# EAGLE design sw-4416-project-v2 (EAGLE 6.2)
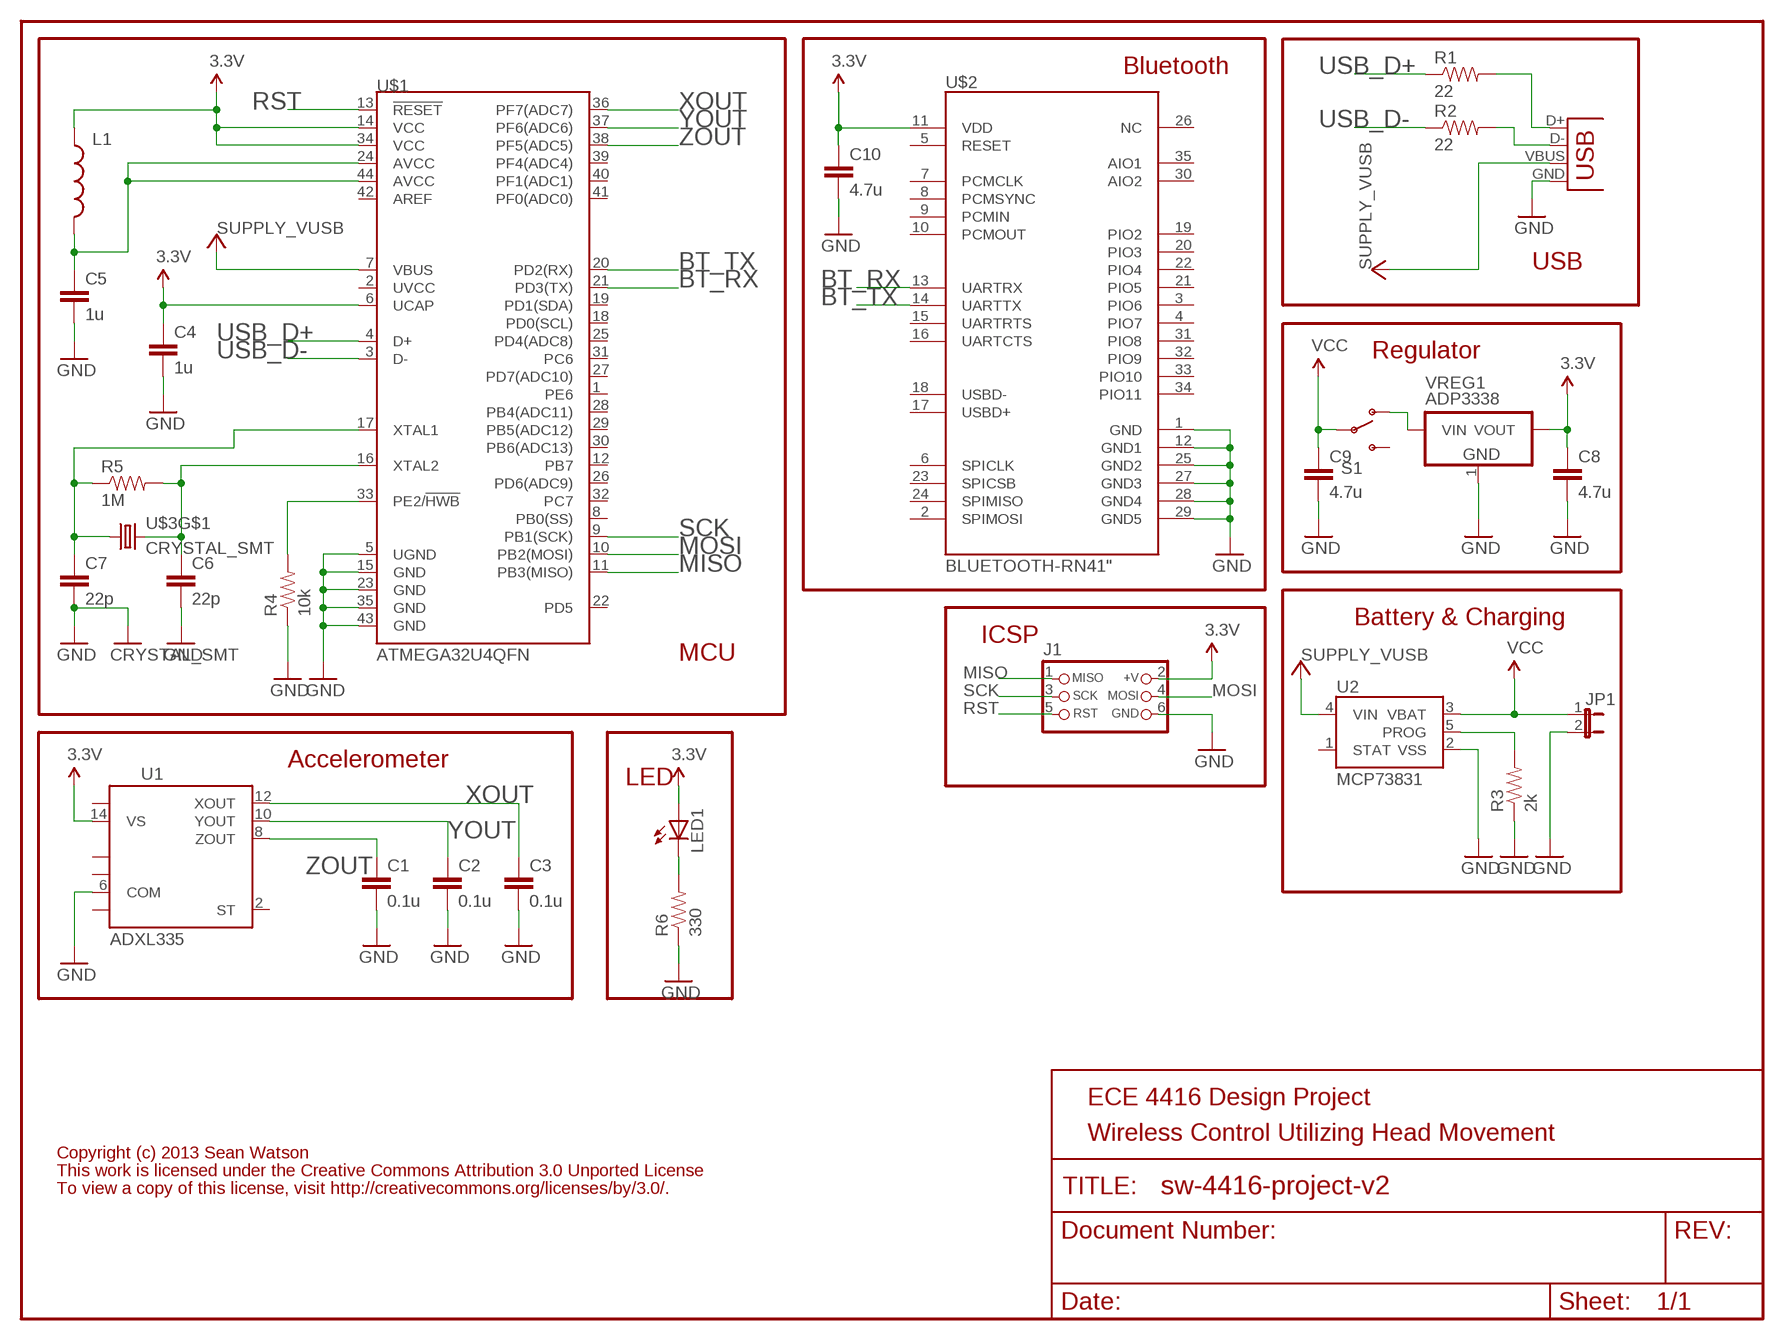
[diagram p0: schematic, sheet 1]

## Parts
C1  0.1u  CAP0603-CAP  [0603-CAP]
C2  0.1u  CAP0603-CAP  [0603-CAP]
C3  0.1u  CAP0603-CAP  [0603-CAP]
C4  1u  CAP0603-CAP  [0603-CAP]
C5  1u  CAP0603-CAP  [0603-CAP]
C6  22p  CAP0603-CAP  [0603-CAP]
C7  22p  CAP0603-CAP  [0603-CAP]
C8  4.7u  CAP0603-CAP  [0603-CAP]
C9  4.7u  CAP0603-CAP  [0603-CAP]
C10  4.7u  CAP0603-CAP  [0603-CAP]
J1  CON_HEADER_PRG_AVR_ICSP"  [HEADER_PRG_2X03_SMD]
JP1  JUMPER-2PTH  [1X02]
L1  INDUCTOR0805  [0805]
LED1  LED0603  [LED-0603]
R1  22  RESISTOR0603-RES  [0603-RES]
R2  22  RESISTOR0603-RES  [0603-RES]
R3  2k  RESISTOR0603-RES  [0603-RES]
R4  10k  RESISTOR0603-RES  [0603-RES]
R5  1M  RESISTOR0603-RES  [0603-RES]
R6  330  RESISTOR0603-RES  [0603-RES]
S1  SWITCH-SPST-SMD-A  [SWITCH-SPST-SMD-A]
U1  ADXL335  [LFCSP-16]
U2  MCP73831  [SOT23-5]
U$1  ATMEGA32U4QFN  [QFN-44]
U$2  BLUETOOTH-RN41"  [RN41]
U$3  CRYSTAL_SMT  [CRYSTAL-SMD-5X3]
VREG1  ADP3338  VREG_3PINS-SOT-223  [SOT-223]
X1  USB-MICROB  [USB-MICROB]

## Nets
3.3V: C4.1 C8.1 C10.1 J1.2(+V) L1.1 LED1.A U1.14(VS) U$1.6(UCAP) U$1.14(VCC) U$1.34(VCC) U$2.11(VDD) VREG1.2(VOUT)
BT_RX: U$1.21(PD3(TX)) U$2.13(UARTRX)
BT_TX: U$1.20(PD2(RX)) U$2.14(UARTTX)
GND: C1.2 C2.2 C3.2 C4.2 C5.2 C6.2 C7.2 C8.2 C9.2 C10.2 J1.6(GND) JP1.2 R3.1 R4.1 R6.1 U1.6(COM) U2.2(VSS) U$1.5(UGND) U$1.15(GND) U$1.23(GND) U$1.35(GND) U$1.43(GND) U$2.1(GND) U$2.12(GND1) U$2.25(GND2) U$2.27(GND3) U$2.28(GND4) U$2.29(GND5) U$3.2(GND) U$3.4(GND) VREG1.1(GND) X1.GND
MISO: J1.1(MISO) U$1.11(PB3(MISO))
MOSI: J1.4(MOSI) U$1.10(PB2(MOSI))
N$1: S1.1(O) VREG1.3(VIN)
N$2: R2.2 X1.D-
N$3: R1.2 X1.D+
N$4: R4.2 U$1.33(PE2/!HWB)
N$5: R3.2 U2.5(PROG)
N$7: C5.1 L1.2 U$1.24(AVCC) U$1.44(AVCC)
N$9: C6.1 R5.2 U$1.16(XTAL2) U$3.3
N$10: C7.1 R5.1 U$1.17(XTAL1) U$3.1
N$27: LED1.C R6.2
RST: J1.5(RST) U$1.13(!RESET)
SCK: J1.3(SCK) U$1.9(PB1(SCK))
USB_D+: R1.1 U$1.4(D+)
USB_D-: R2.1 U$1.3(D-)
VCC: C9.1 JP1.1 S1.2(P) U2.3(VBAT)
VUSB: U2.4(VIN) U$1.7(VBUS) X1.VBUS ; supply symbol labelled SUPPLY_VUSB
XOUT: C3.1 U1.12(XOUT) U$1.36(PF7(ADC7))
YOUT: C2.1 U1.10(YOUT) U$1.37(PF6(ADC6))
ZOUT: C1.1 U1.8(ZOUT) U$1.38(PF5(ADC5))
Unconnected: S1.3(S) U1.2(ST) U1.3(COM) U1.5(COM) U1.7(COM) U1.15(VS) U2.1(STAT) U$1.1(PE6) U$1.2(UVCC) U$1.8(PB0(SS)) U$1.12(PB7) U$1.18(PD0(SCL)) U$1.19(PD1(SDA)) U$1.22(PD5) U$1.25(PD4(ADC8)) U$1.26(PD6(ADC9)) U$1.27(PD7(ADC10)) U$1.28(PB4(ADC11)) U$1.29(PB5(ADC12)) U$1.30(PB6(ADC13)) U$1.31(PC6) U$1.32(PC7) U$1.39(PF4(ADC4)) U$1.40(PF1(ADC1)) U$1.41(PF0(ADC0)) U$1.42(AREF) U$2.2(SPIMOSI) U$2.3(PIO6) U$2.4(PIO7) U$2.5(RESET) U$2.6(SPICLK) U$2.7(PCMCLK) U$2.8(PCMSYNC) U$2.9(PCMIN) U$2.10(PCMOUT) U$2.15(UARTRTS) U$2.16(UARTCTS) U$2.17(USBD+) U$2.18(USBD-) U$2.19(PIO2) U$2.20(PIO3) U$2.21(PIO5) U$2.22(PIO4) U$2.23(SPICSB) U$2.24(SPIMISO) U$2.26(NC) U$2.30(AIO2) U$2.31(PIO8) U$2.32(PIO9) U$2.33(PIO10) U$2.34(PIO11) U$2.35(AIO1)

## Notes on the sheet
- Bluetooth
- USB
- Regulator
- Battery & Charging
- ICSP
- MCU
- Accelerometer
- LED
- ECE 4416 Design Project
- Wireless Control Utilizing Head Movement
- Copyright (c) 2013 Sean Watson
- This work is licensed under the Creative Commons Attribution 3.0 Unported License
- To view a copy of this license, visit http://creativecommons.org/licenses/by/3.0/.

## Library data of the parts
C1-C10 = SparkFun:CAP: Capacitor Standard 0603 ceramic capacitor, and 0.1" leaded capacitor.
J1 = dp_devices:CON_HEADER_PRG_AVR_ICSP: 2x3 AVR ICSP programming header
JP1 = SparkFun:JUMPER-2: Jumper Basic 0.1" spaced jumper. Use with breakaway headers.
L1 = SparkFun:INDUCTOR: Inductors Basic Inductor/Choke - 0603 and 1206. Footprints are not proven and vary greatly between part numbers.
LED1 = SparkFun:LED: LEDs Standard schematic elements and footprints for 5mm, 3mm, 1206, and 0603 sized LEDs. 5mm - Spark Fun Electronics SKU : COM-00529 (and others)
R1-R6 = SparkFun:RESISTOR: Resistor Basic schematic elements and footprints for 0603, 1206, and PTH resistors.
S1 = SparkFun:SWITCH-SPST: SPST Switch Simple slide switch. Spark Fun Electronics SKU : COM-00102
U1 = SparkFun:ADXL335
U2 = SparkFun:MCP73831: Microchip's MCP73831 Miniature single cell, fully integrated Li-Ion, Li-polymer charge management controller http://ww1.microchip.com/downloads/en/DeviceDoc/21984a.pdf
U$1 = SparkFun:ATMEGA32U4
U$2 = SparkFun:BLUETOOTH-RN41
U$3 = SparkFun:CRYSTAL_SMT
VREG1 = dp_devices:VREG_3PINS: Various 3 pin voltage regulators in different packages Double check the right pinout for the right part
X1 = SparkFun:USB: USB Connectors USB-B-PTH is fully proven SKU : PRT-00139 USB-miniB is fully proven SKU : PRT-00587 USB-A-PCB is untested. USB-A-H is throughly reviewed, but untested. Spark Fun Electronics SKU : PRT-00437 USB-B-SMT is throughly reviewed, but untested. Needs silkscreen touching up. USB-A-S has not been used/tested USB-MB-H has not been used/tested

## Board
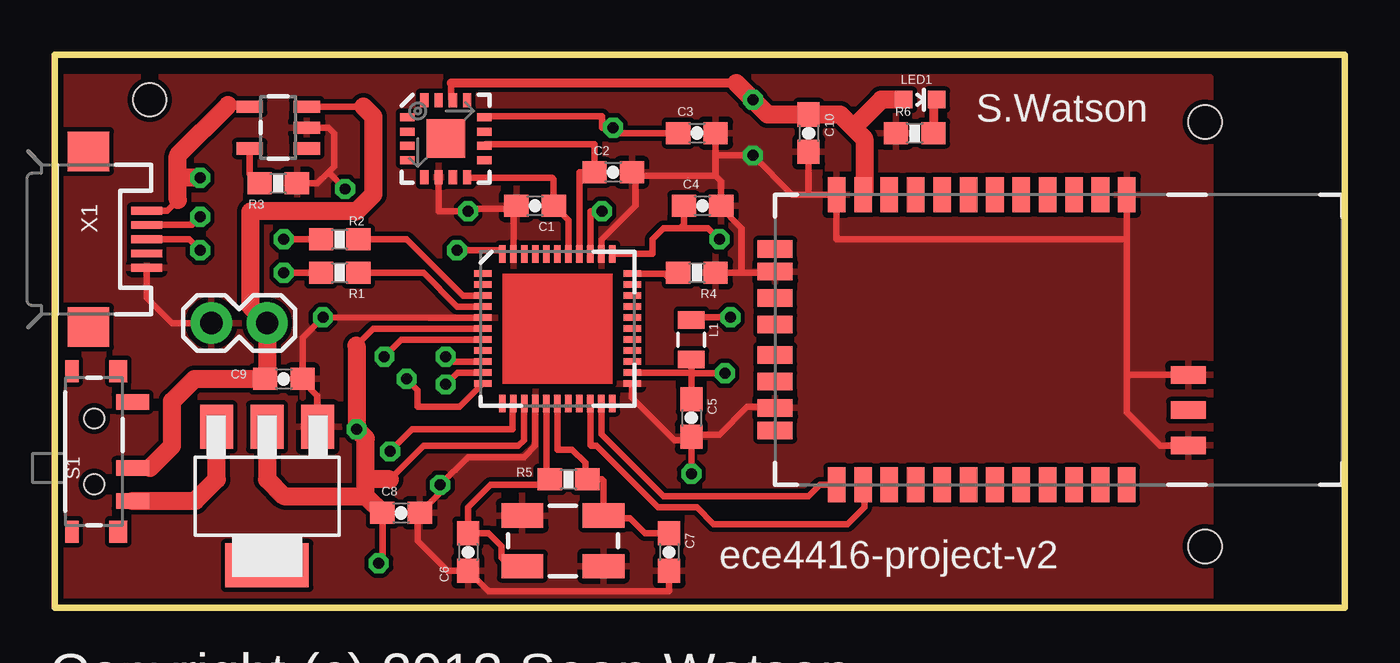
[diagram p1: board, top side]
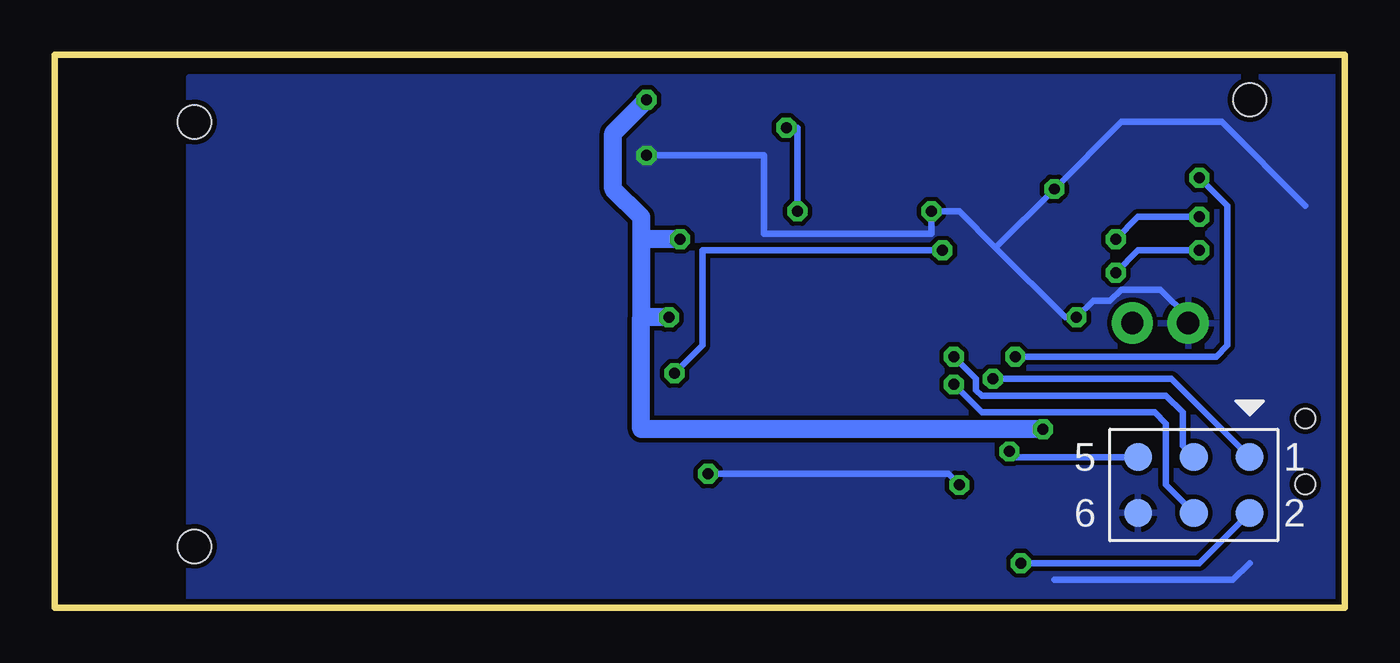
[diagram p2: board, bottom side, seen from below]

Size 58.67 x 25.15 mm. Coordinates in mm from the lower left corner, seen from the top.
Outline: 0,0 0,25.15 58.67,25.15 58.67,0 0,0
Copper layers (1*16): Top 0.035mm / dielectric 1.5mm / Bottom 0.035mm
Design rules: minimum track width 8mil, minimum drill 20mil, track to track 8mil, track to pad 8mil, pad to pad 8mil, via to via 8mil, smd to smd 8mil, copper to edge 10mil, drill to drill 8mil, minimum pad ring 10mil, minimum via ring 8mil, stop-mask expansion 4mil, vias tented up to drill 0mil, thermal gap 10mil
Holes 1.5 mm at 52.32,22.1 52.32,2.79 4.32,23.11

### Footprints (pad centres in the part's own frame; a part is rotated, then mirrored left to right if it is on the bottom)
0603-CAP = smd 1.1 x 1: 1 -0.85,0; 2 0.85,0
HEADER_PRG_2X03_SMD = smd 1.27 x 1.27: 1 -2.54,-1.27; 2 -2.54,1.27; 3 0,-1.27; 4 0,1.27; 5 2.54,-1.27; 6 2.54,1.27
1X02 = drill 1.016 pad 1.88: 1 0,0; 2 2.54,0
0805 = smd 0.8 x 1.2: 1 -0.9,0; 2 0.9,0
LED-0603 = smd 0.8 x 0.8: A 0,-0.75; C 0,0.75
0603-RES = smd 1.1 x 1: 1 -0.85,0; 2 0.85,0
SWITCH-SPST-SMD-A = smd 0.7 x 1.5: 1 -2.25,-1.75; 2 -0.75,-1.75; 3 2.25,-1.75 | smd 1 x 0.6: GND1 -3.65,1; GND3 3.65,1 | smd 1 x 0.8: GND2 -3.65,-1.1; GND4 3.65,-1.1 | hole 0.9: -1.5,0; 1.5,0
LFCSP-16 = smd 1.75 x 1.75: 0 0,0 | smd 0.65 x 0.37: 1 -1.75,0.975; 2 -1.75,0.325; 3 -1.75,-0.325; 4 -1.75,-0.975; 9 1.75,-0.975; 10 1.75,-0.325; 11 1.75,0.325; 12 1.75,0.975 | smd 0.37 x 0.65: 5 -0.975,-1.75; 6 -0.325,-1.75; 7 0.325,-1.75; 8 0.975,-1.75; 13 0.975,1.75; 14 0.325,1.75; 15 -0.325,1.75; 16 -0.975,1.75
SOT23-5 = smd 0.55 x 1.2: 1 -0.95,-1.3; 2 0,-1.3; 3 0.95,-1.3; 4 0.95,1.3; 5 -0.95,1.3
QFN-44 = smd 0.8 x 0.3: 1 -3.4,2.5; 2 -3.4,2; 3 -3.4,1.5; 4 -3.4,1; 5 -3.4,0.5; 6 -3.4,0; 7 -3.4,-0.5; 8 -3.4,-1; 9 -3.4,-1.5; 10 -3.4,-2; 11 -3.4,-2.5; 23 3.4,-2.5; 24 3.4,-2; 25 3.4,-1.5; 26 3.4,-1; 27 3.4,-0.5; 28 3.4,0; 29 3.4,0.5; 30 3.4,1; 31 3.4,1.5; 32 3.4,2; 33 3.4,2.5 | smd 0.3 x 0.8: 12 -2.5,-3.4; 13 -2,-3.4; 14 -1.5,-3.4; 15 -1,-3.4; 16 -0.5,-3.4; 17 0,-3.4; 18 0.5,-3.4; 19 1,-3.4; 20 1.5,-3.4; 21 2,-3.4; 22 2.5,-3.4; 34 2.5,3.4; 35 2,3.4; 36 1.5,3.4; 37 1,3.4; 38 0.5,3.4; 39 0,3.4; 40 -0.5,3.4; 41 -1,3.4; 42 -1.5,3.4; 43 -2,3.4; 44 -2.5,3.4
RN41 = smd 0.8 x 1.6: 1 -6.6,-6.6; 2 -5.4,-6.6; 3 -4.2,-6.6; 4 -3,-6.6; 5 -1.8,-6.6; 6 -0.6,-6.6; 7 0.6,-6.6; 8 1.8,-6.6; 9 3,-6.6; 10 4.2,-6.6; 11 5.4,-6.6; 12 6.6,-6.6; 13 6.6,6.6; 14 5.4,6.6; 15 4.2,6.6; 16 3,6.6; 17 1.8,6.6; 18 0.6,6.6; 19 -0.6,6.6; 20 -1.8,6.6; 21 -3,6.6; 22 -4.2,6.6; 23 -5.4,6.6; 24 -6.6,6.6 | smd 1.6 x 0.8: 25 -9.4,4.8; 26 -9.4,3.2; 27 -9.4,1.6; 28 9.4,3.1; 29 9.4,-3.1; 30 9.4,-4.122; 31 9.4,-1.9; 32 9.4,-0.7; 33 9.4,0.7; 34 9.4,1.9; 35 9.4,4.122
CRYSTAL-SMD-5X3 = smd 1.9 x 1.1: 1 -1.85,-1.15; 2 1.85,-1.15; 3 1.85,1.15; 4 -1.85,1.15
SOT-223 = smd 1.5 x 2: 1 -2.3,-3.15; 2 0,-3.15; 3 2.3,-3.15 | smd 3.8 x 2: 4 0,3.15
USB-MICROB = smd 0.35 x 1.4: D+ 0,2.65; D- -0.65,2.65; GND 1.3,2.65; ID 0.65,2.65; VBUS -1.3,2.65 | smd 1.8 x 1.9: MT1 -4,0; MT2 4,0

### Placement (x,y rotation side)
C1  21.84,18.29 180 top
C2  25.4,19.81 0 top
C3  29.21,21.59 0 top
C4  29.46,18.29 0 top
C5  28.96,8.64 270 top
C6  18.8,2.54 270 top
C7  27.94,2.54 270 top
C8  15.75,4.32 0 top
C9  10.41,10.41 0 top
C10  34.29,21.59 270 top
J1  6.86,5.59 180 bottom
JP1  9.65,12.95 180 top
L1  28.96,12.19 270 top
LED1  39.37,23.11 270 top
R1  12.95,15.24 180 top
R2  12.95,16.76 180 top
R3  10.16,19.3 180 top
R4  29.21,15.24 180 top
R5  23.37,5.84 180 top
R6  39.12,21.59 0 top
S1  1.78,7.11 90 top
U1  17.78,21.34 0 top
U2  10.16,21.84 90 top
U$1  22.86,12.7 0 top
U$2  42.16,12.19 180 top
U$3  23.11,3.05 180 top
VREG1  9.65,5.08 180 top
X1  1.52,16.76 270 top

### Tracks (layer width: path | path; a pad name or v marks a point on that pad's centre or on a via)
3.3V  (via drill 0.5)
  Top 0.305: L1.1 29.07,13.21 v30.73,13.21 | U1.14 18.03,23.16 18.03,23.88 | U$1.34 27.18,16.1 27.18,16.76 27.69,17.27 28.45,17.27 | U$1.6 14.48,12.7 13.72,11.94 | U$1.14 21.34,9.28 21.34,7.62 21.08,7.37 16.76,7.37 15.24,5.84 | C4.1 28.61,17.44 28.45,17.27 | 28.45,17.27 29.72,17.27 v30.23,16.76 | 36.83,18.86 U$2.11 | v14.73,2.03 14.9,2.2 C8.1
  Top 0.406: 18.03,23.88 30.99,23.88
  Top 0.813: VREG1.2 9.65,5.84 10.41,5.08 14.14,5.08 | 14.14,5.08 C8.1 | 14.14,5.08 14.14,5.84 | 14.14,5.84 14.14,7.71 v13.72,8.13 13.72,11.94 | 15.24,5.84 14.14,5.84 | 30.99,23.88 v31.75,23.11 32.42,22.44 C10.1 35.73,22.44 36.32,21.84 | 36.32,21.84 36.83,21.34 36.83,18.86 | LED1.A 37.59,23.11 36.32,21.84
  Bottom 0.305: J1.2 6.6,2.03 v14.73,2.03
  Bottom 0.813: v13.72,8.13 32,8.13 32,13.21 | v31.75,23.11 33.27,21.59 33.27,19.05 32,17.78 32,17.02 | v30.73,13.21 32,13.21 | 32,17.02 32,13.21 | v30.23,16.76 31.75,16.76 32,17.02
BT_RX
  Top 0.305: U$1.21 24.86,7.91 27.69,5.08 34.29,5.08 34.8,5.59 U$2.13
BT_TX
  Top 0.305: U$1.20 24.36,7.39 24.38,7.37 24.64,7.37 27.43,4.57 29.21,4.57 29.97,3.81 36.07,3.81 36.83,4.57 36.83,5.53 U$2.14
GND  (via drill 0.5)
  Top 0.305: 12.19,8.13 12.29,8.23 VREG1.1 11.94,8.24 11.94,9.65 11.26,10.33 C9.2 11.26,12.28 v12.19,13.21 17.02,13.2 U$1.5 | C5.2 29.04,7.87 30.23,7.87 31.5,9.14 32.71,9.14 U$2.28 | C1.2 20.86,18.15 | 20.86,18.15 U$1.43 | C2.2 26.42,19.65 | 26.42,19.65 26.42,18.29 24.86,16.73 U$1.35 | U1.6 17.45,18.03 v18.8,18.03 18.8,18.15 20.86,18.15 | 26.42,19.65 30.06,19.65 | 30.06,19.65 30.06,20.57 | 30.06,20.57 C3.2 | R3.1 11.94,19.3 12.45,19.81 | U2.2 12.45,21.84 12.7,21.59 12.7,20.07 12.45,19.81 | X1.GND 4.17,14.11 5.33,12.95 JP1.2 | C7.2 27.94,0.76 19.72,0.76 C6.2 17.87,1.69 16.51,3.05 16.51,4.23 C8.2 17.53,5.25 v17.53,5.59 18.8,6.86 21.34,6.86 21.84,7.37 21.84,9.28 U$1.15 | 12.45,19.81 v13.21,19.05 | U$1.23 26.26,9.55 28.19,7.62 28.79,7.62 C5.2 | C5.2 v28.96,6.1 | R4.1 31.24,15.24 | 31.24,15.24 32.71,15.24 U$2.29 | U$2.1 48.76,16.76 | 48.76,16.76 48.76,10.67 | 48.76,10.67 48.76,8.89 50.29,7.37 51.54,7.37 U$2.25 | U$2.27 48.84,10.59 48.76,10.67 | 30.06,19.65 30.31,19.39 C4.2 30.23,18.29 31.24,17.27 31.24,15.24 | v31.75,20.57 30.23,20.57 | v31.75,20.57 30.06,20.57 | v31.75,20.57 33.53,18.79 34.29,18.79 | 34.29,18.79 U$2.12 35.56,16.76 48.76,16.76 | C10.2 34.29,18.79
  Bottom 0.305: v31.75,20.57 26.42,20.57 26.42,17.02 18.8,17.02 v18.8,18.03 17.53,18.03 15.88,16.38 | 15.88,16.38 12.7,13.21 v12.19,13.21 11.43,13.97 10.67,13.97 10.16,14.48 8.38,14.48 7.11,13.21 JP1.2 | 15.88,16.38 v13.21,19.05 10.16,22.1 5.59,22.1 1.78,18.29 | v28.96,6.1 18.03,6.1 v17.53,5.59 | 4.32,2.03 5.08,1.27 13.21,1.27
  pour Top: 52.58,0.25 52.58,24.13 0.25,24.13 0.25,0.25
  pour Bottom: 52.58,0.25 52.58,24.13 0.25,24.13 0.25,0.25
MISO  (via drill 0.5)
  Top 0.305: v16,10.41 16.51,9.91 16.51,9.14 18.4,9.14 U$1.11
  Bottom 0.305: J1.1 7.87,10.41 v16,10.41
MOSI  (via drill 0.5)
  Top 0.305: v17.78,10.16 18.32,10.7 U$1.10
  Bottom 0.305: J1.4 8.13,5.59 8.13,8.38 8.64,8.89 16.51,8.89 v17.78,10.16
N$1
  Top 0.305: 7.37,8.22 VREG1.3
  Top 0.813: S1.1 6.39,4.86 7.37,5.84 7.37,8.22
N$2  (via drill 0.5)
  Top 0.305: X1.D- 6.24,17.41 v6.6,17.78 | R2.2 v10.41,16.76
  Bottom 0.305: v6.6,17.78 9.4,17.78 v10.41,16.76
N$3  (via drill 0.5)
  Top 0.305: X1.D+ 6.1,16.76 v6.6,16.26 | R1.2 v10.41,15.24
  Bottom 0.305: v6.6,16.26 9.4,16.26 v10.41,15.24
N$4
  Top 0.305: R4.2 28.19,15.24 27.94,14.99 27.73,15.2 U$1.33
N$5
  Top 0.305: R3.2 8.86,19.75 U2.5
N$6  (via drill 0.5)
  other vias: 18.8,18.03
N$7  (via drill 0.5)
  Top 0.305: 26.29,10.67 U$1.24 28.92,10.7 28.96,10.67 | U$1.44 20.2,16.26 v18.29,16.26 | 28.96,10.67 L1.2 | 28.96,10.67 C5.1 | 28.96,10.67 v30.48,10.67
  Bottom 0.305: v18.29,16.26 29.21,16.26 29.21,11.94 v30.48,10.67
N$8  (via drill 0.5)
  other vias: 13.21,19.05
N$9
  Top 0.305: U$1.16 22.36,6 R5.2 22.26,5.59 19.81,5.59 18.8,4.57 C6.1 19.72,3.39 20.32,2.79 20.32,2.29 20.71,1.9 U$3.3
N$10
  Top 0.305: U$1.17 22.86,7.2 23.53,7.2 24.13,6.6 24.13,5.93 R5.1 24.89,5.84 24.96,5.77 U$3.1 25.1,4.2 25.1,4.06 26.16,4.06 26.84,3.39 C7.1
N$11  (via drill 0.5)
  other vias: 14.99,11.43
N$12  (via drill 0.5)
  other vias: 30.73,13.21
N$13  (via drill 0.5)
  other vias: 24.89,18.03
N$14  (via drill 0.5)
  other vias: 25.4,21.84
N$15  (via drill 0.5)
  other vias: 14.73,2.03
N$16  (via drill 0.5)
  other vias: 17.78,11.43
N$17  (via drill 0.5)
  other vias: 28.96,6.1
N$18  (via drill 0.5)
  other vias: 17.53,5.59
N$19  (via drill 0.5)
  other vias: 18.29,16.26
N$20  (via drill 0.5)
  other vias: 30.48,10.67
N$22  (via drill 0.5)
  other vias: 30.23,16.76
N$23  (via drill 0.5)
  other vias: 17.78,10.16
N$24  (via drill 0.5)
  other vias: 12.19,13.21
N$25  (via drill 0.5)
  other vias: 6.6,19.56
N$26  (via drill 0.5)
  other vias: 16,10.41
N$27
  Top 0.406: LED1.C 39.97,23.11 R6.2
RST  (via drill 0.5)
  Top 0.305: U$1.13 20.83,9.27 20.83,8.13 16.26,8.13 v15.24,7.11
  Bottom 0.305: J1.5 14.99,6.86 v15.24,7.11
SCK  (via drill 0.5)
  Top 0.305: v17.78,11.43 18.01,11.2 U$1.9
  Bottom 0.305: J1.3 7.37,7.37 7.37,8.89 8.13,9.65 16.51,9.65 16.76,9.91 16.76,10.41 v17.78,11.43
USB_D+
  Top 0.305: U$1.4 18.3,13.7 16.76,15.24 R1.1
USB_D-
  Top 0.305: U$1.3 18.57,14.2 16,16.76 R2.1
VCC
  Top 0.305: U2.3 14.04,22.79 | 9.65,10.5 C9.1 | S1.2 4.33,6.36
  Top 0.813: 14.04,22.79 14.48,22.35 14.48,18.8 13.72,18.03 8.89,18.03 8.89,13.72 JP1.1 9.65,10.5 | 4.33,6.36 5.33,7.37 5.33,9.4 6.35,10.41 C9.1
VUSB  (via drill 0.5)
  Top 0.305: X1.VBUS 5.11,18.06 5.59,18.54 | 8.79,22.86 U2.4 | U$1.7 15.76,12.2 v14.99,11.43
  Top 0.406: 7.87,22.86 8.79,22.86
  Top 0.813: 5.59,18.54 5.59,19.56 | 5.59,19.56 5.59,20.57 7.87,22.86 | v6.6,19.56 5.59,19.56
  Bottom 0.305: v14.99,11.43 5.84,11.43 5.33,11.94 5.33,18.29 v6.6,19.56
XOUT  (via drill 0.5)
  Top 0.305: U$1.36 24.36,18.03 v24.89,18.03 | C3.1 25.4,21.59 v25.4,21.84 24.89,21.84 24.89,22.35 19.53,22.35 U1.12
  Bottom 0.305: v24.89,18.03 24.89,21.84 v25.4,21.84
YOUT
  Top 0.305: U$1.37 23.88,16.12 23.88,19.81 C2.1 24.55,21.08 19.6,21.08 U1.10
ZOUT
  Top 0.305: U1.8 18.78,19.56 22.61,19.56 22.69,19.47 C1.1 23.36,17.62 U$1.38

### Text on the board
tNames: S.Watson | ece4416-project-v2 | Copyright (c) 2013 Sean Watson | This work is licensed under the Creative Commons Attribution 3.0 Unported License. | To view a copy of this license, visit http://creativecommons.org/licenses/by/3.0/.